# EAGLE schematic ACB Jr. r.02 (EAGLE 8.6.3)
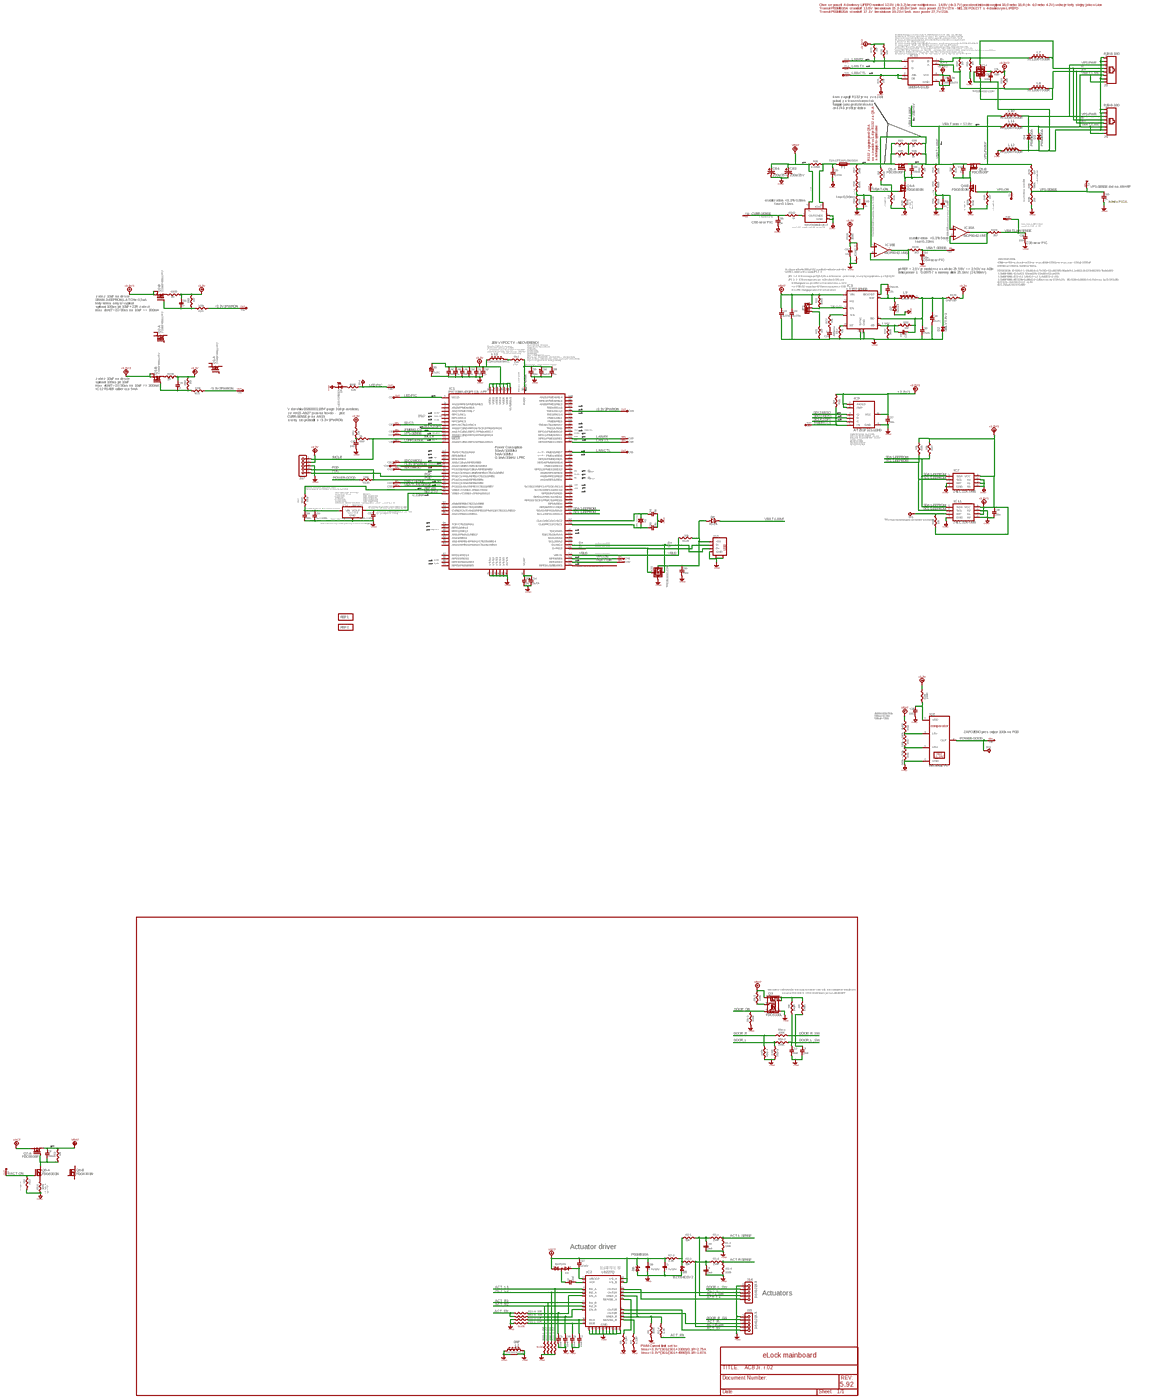
[diagram p0: schematic, sheet 1, overview]
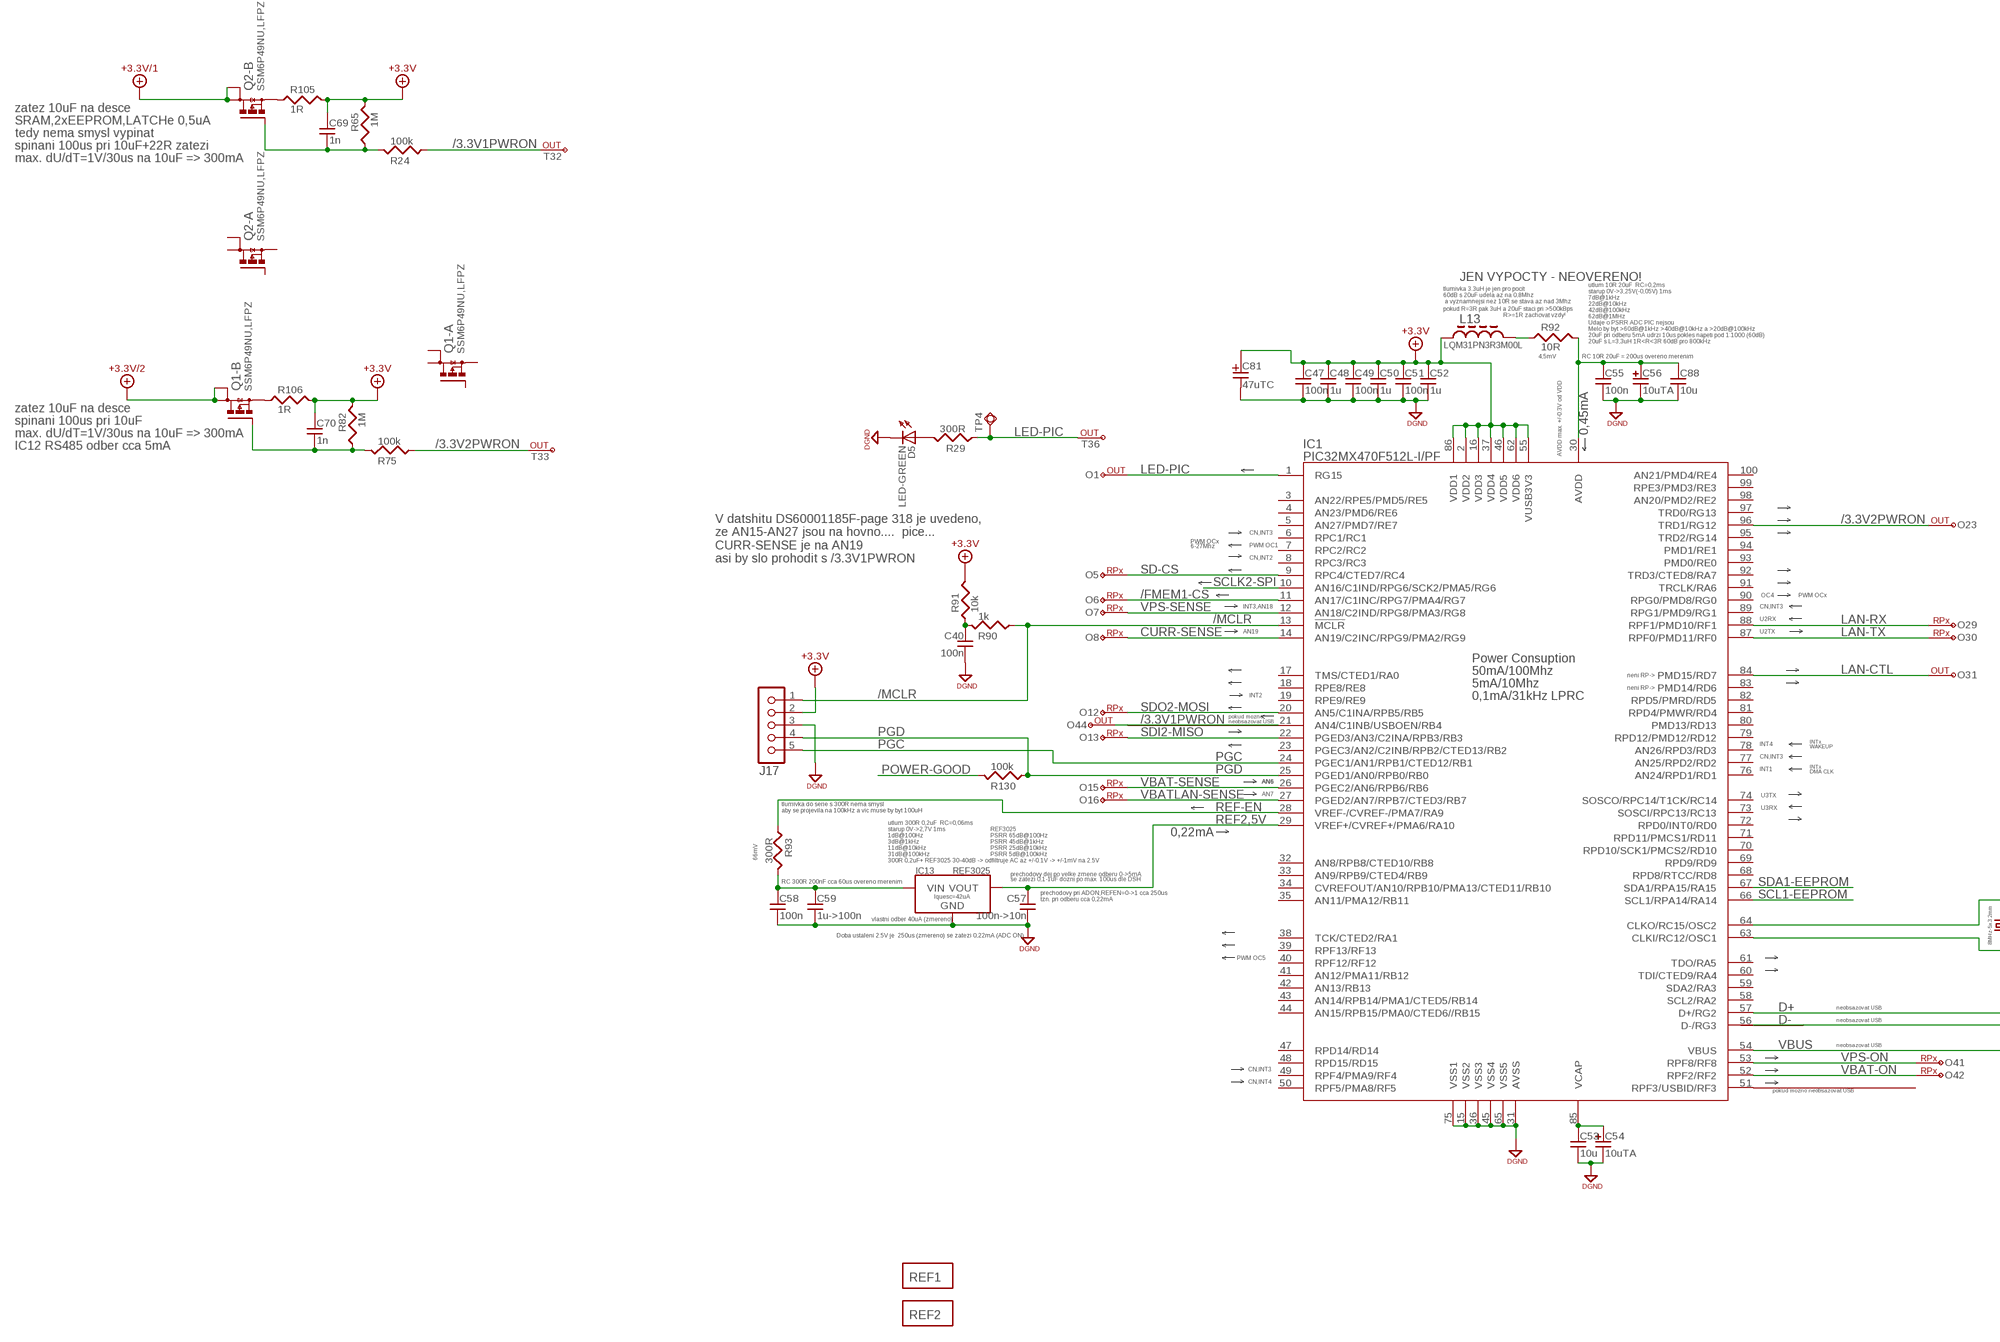
[diagram p1: schematic, sheet 1, part 1 of 5]
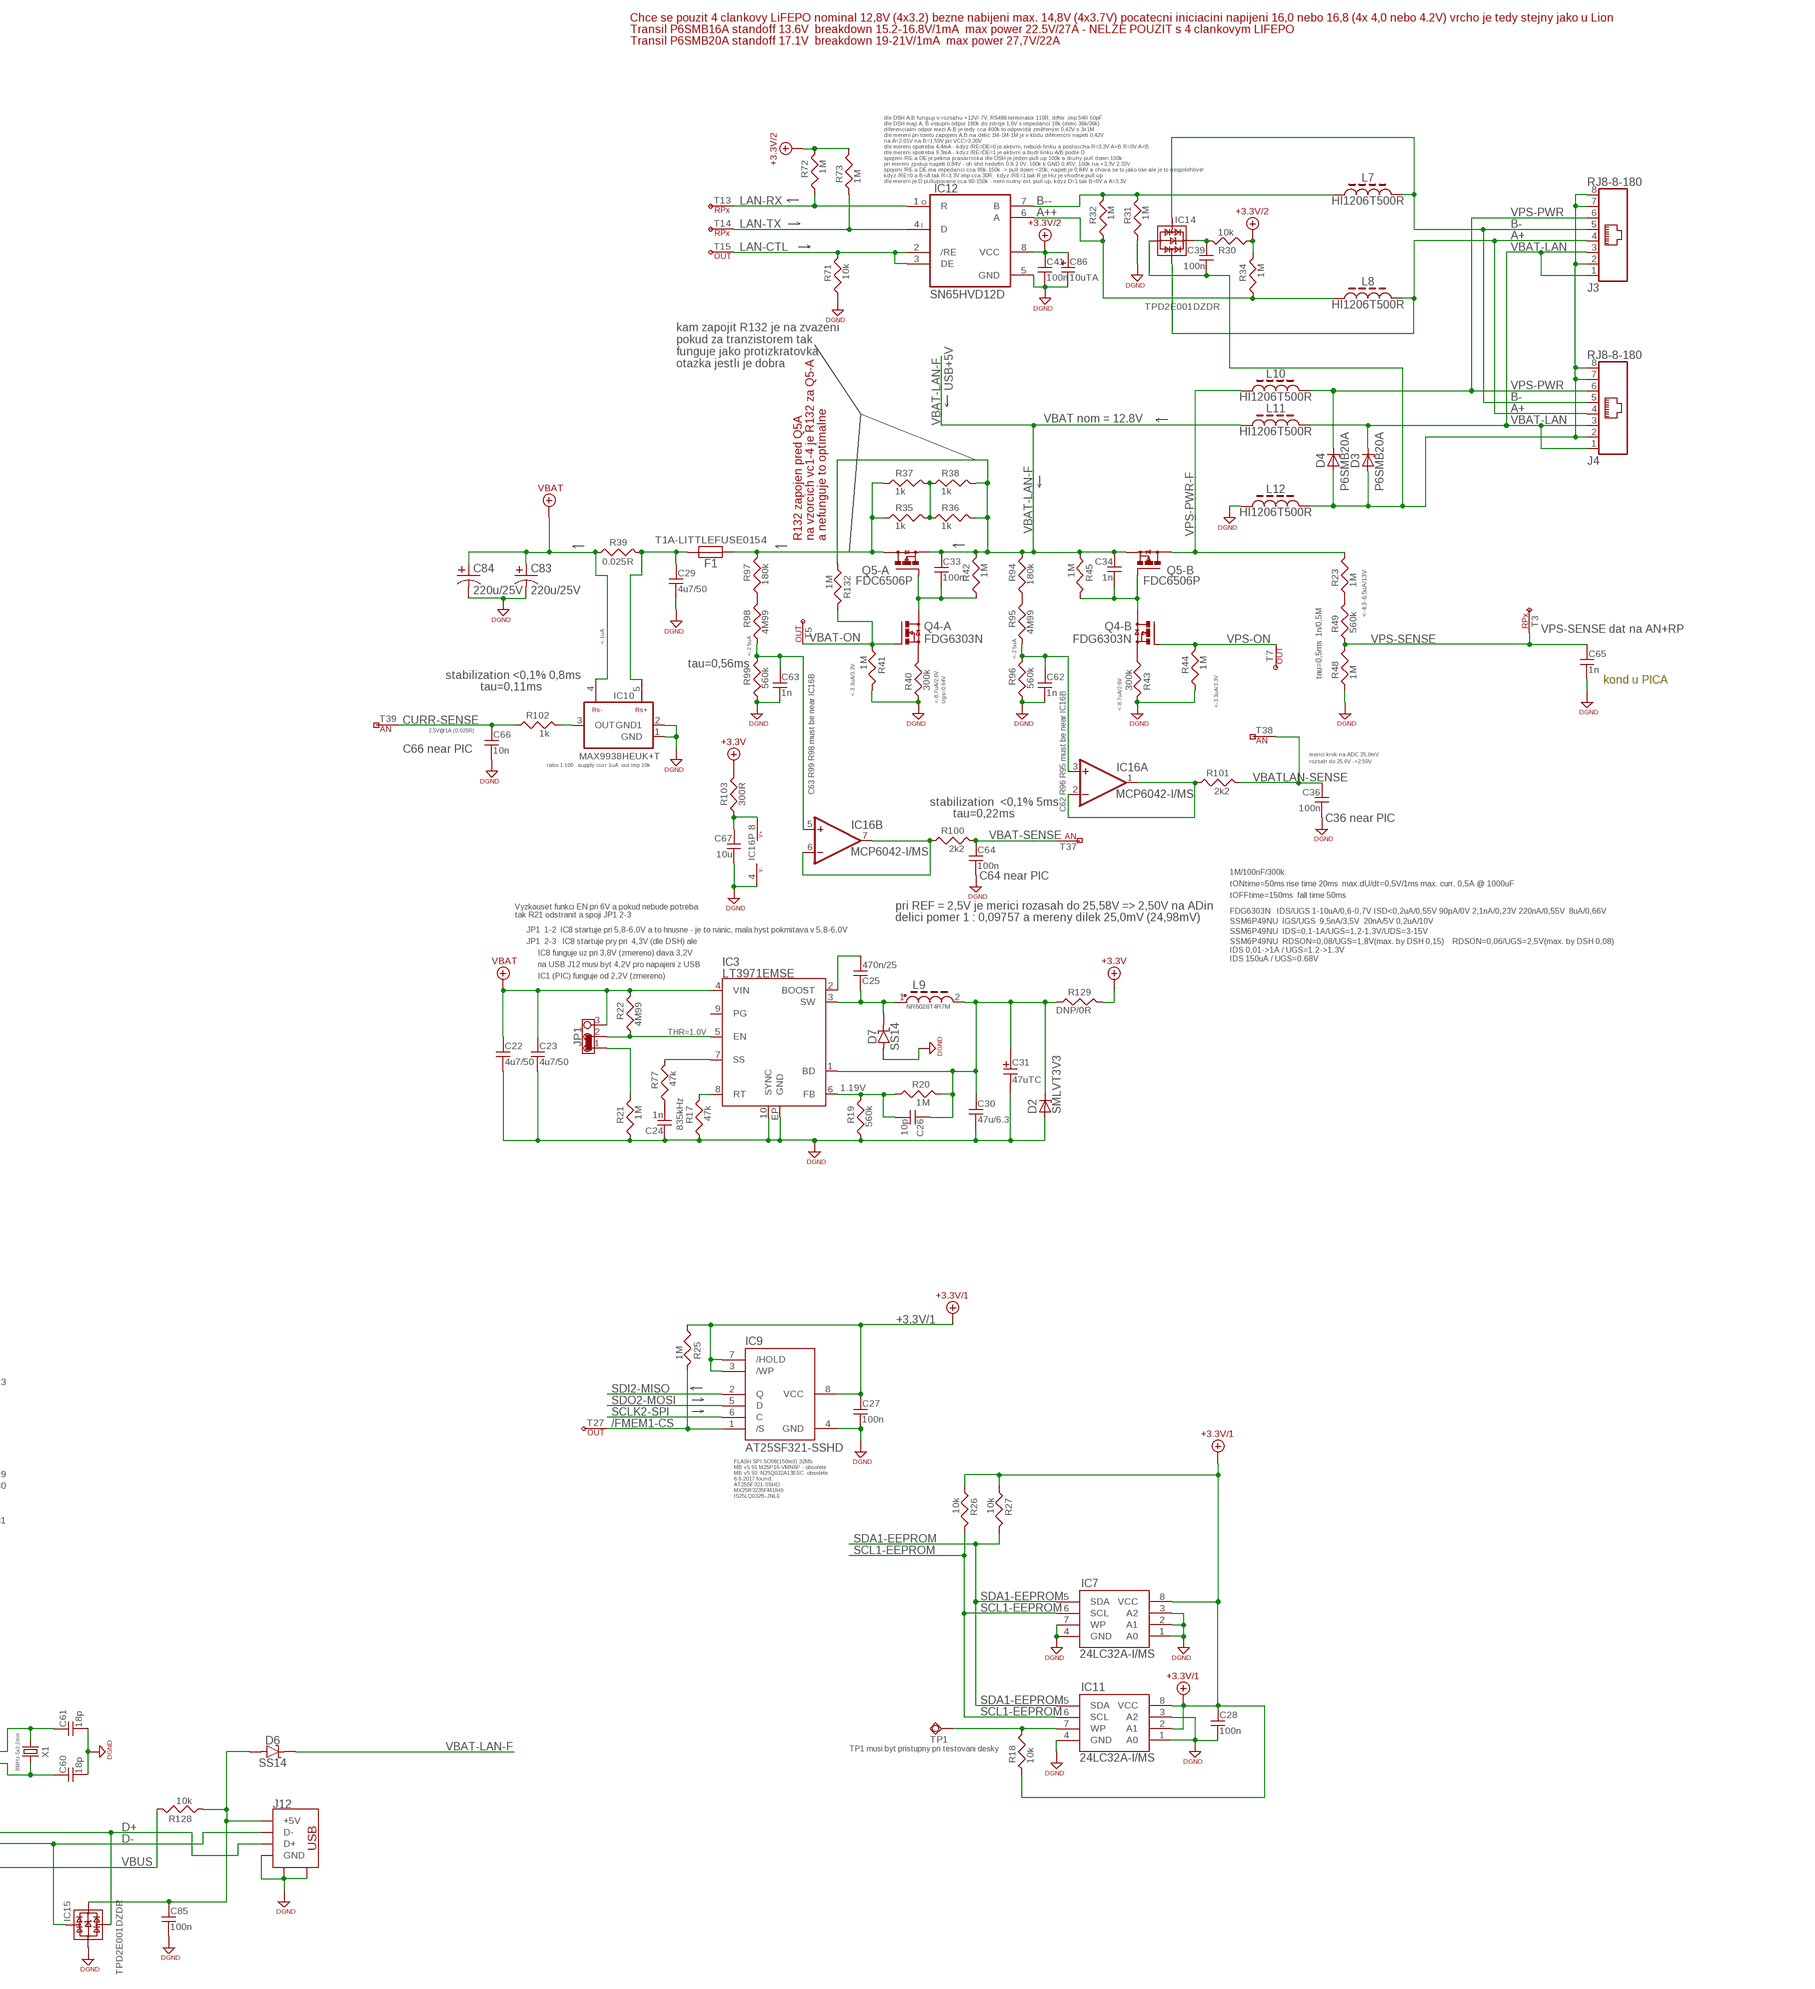
[diagram p2: schematic, sheet 1, part 2 of 5]
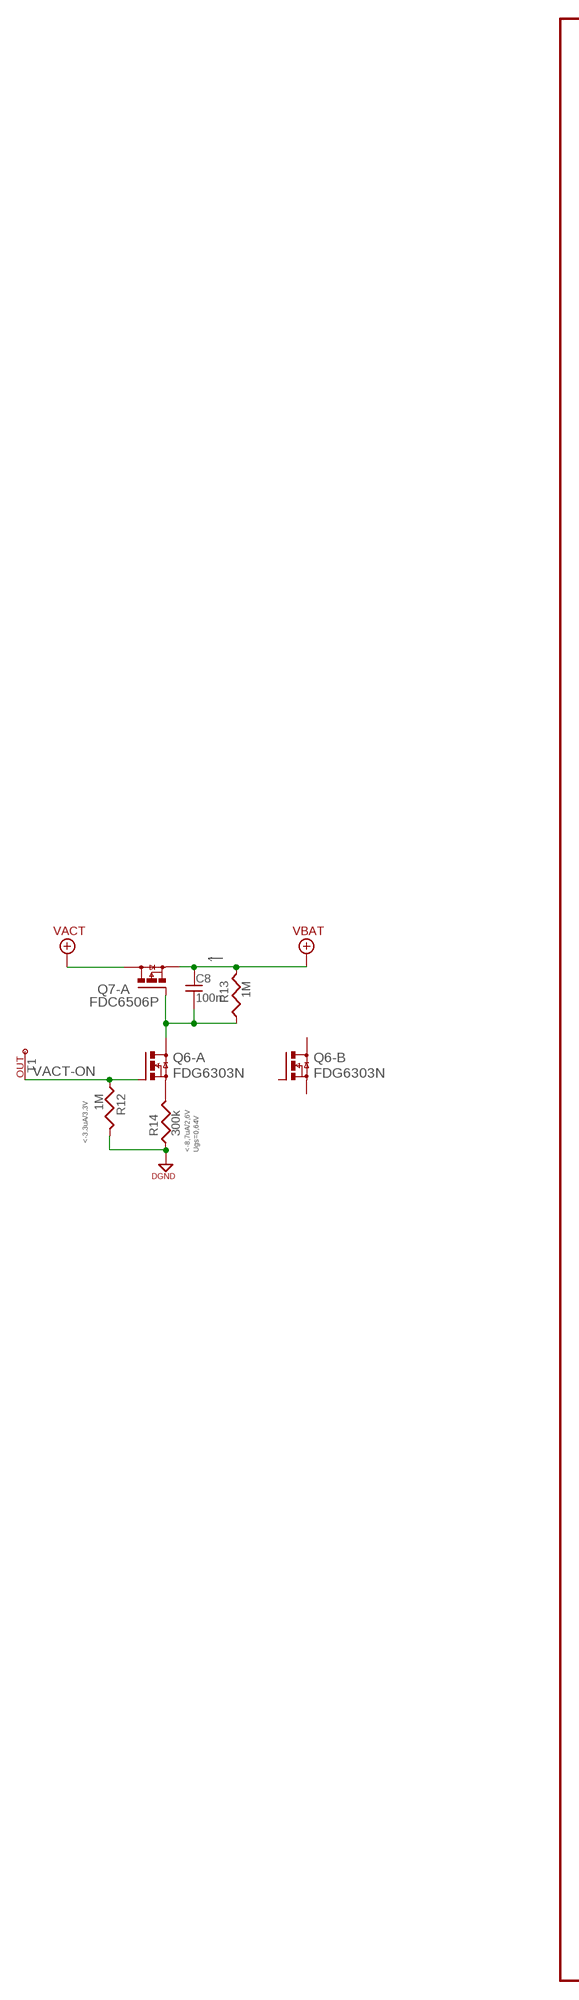
[diagram p3: schematic, sheet 1, part 3 of 5]
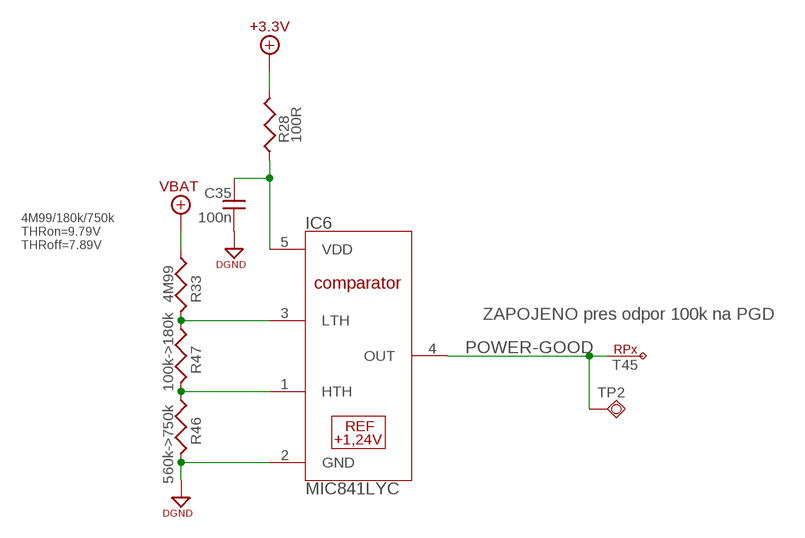
[diagram p4: schematic, sheet 1, part 4 of 5]
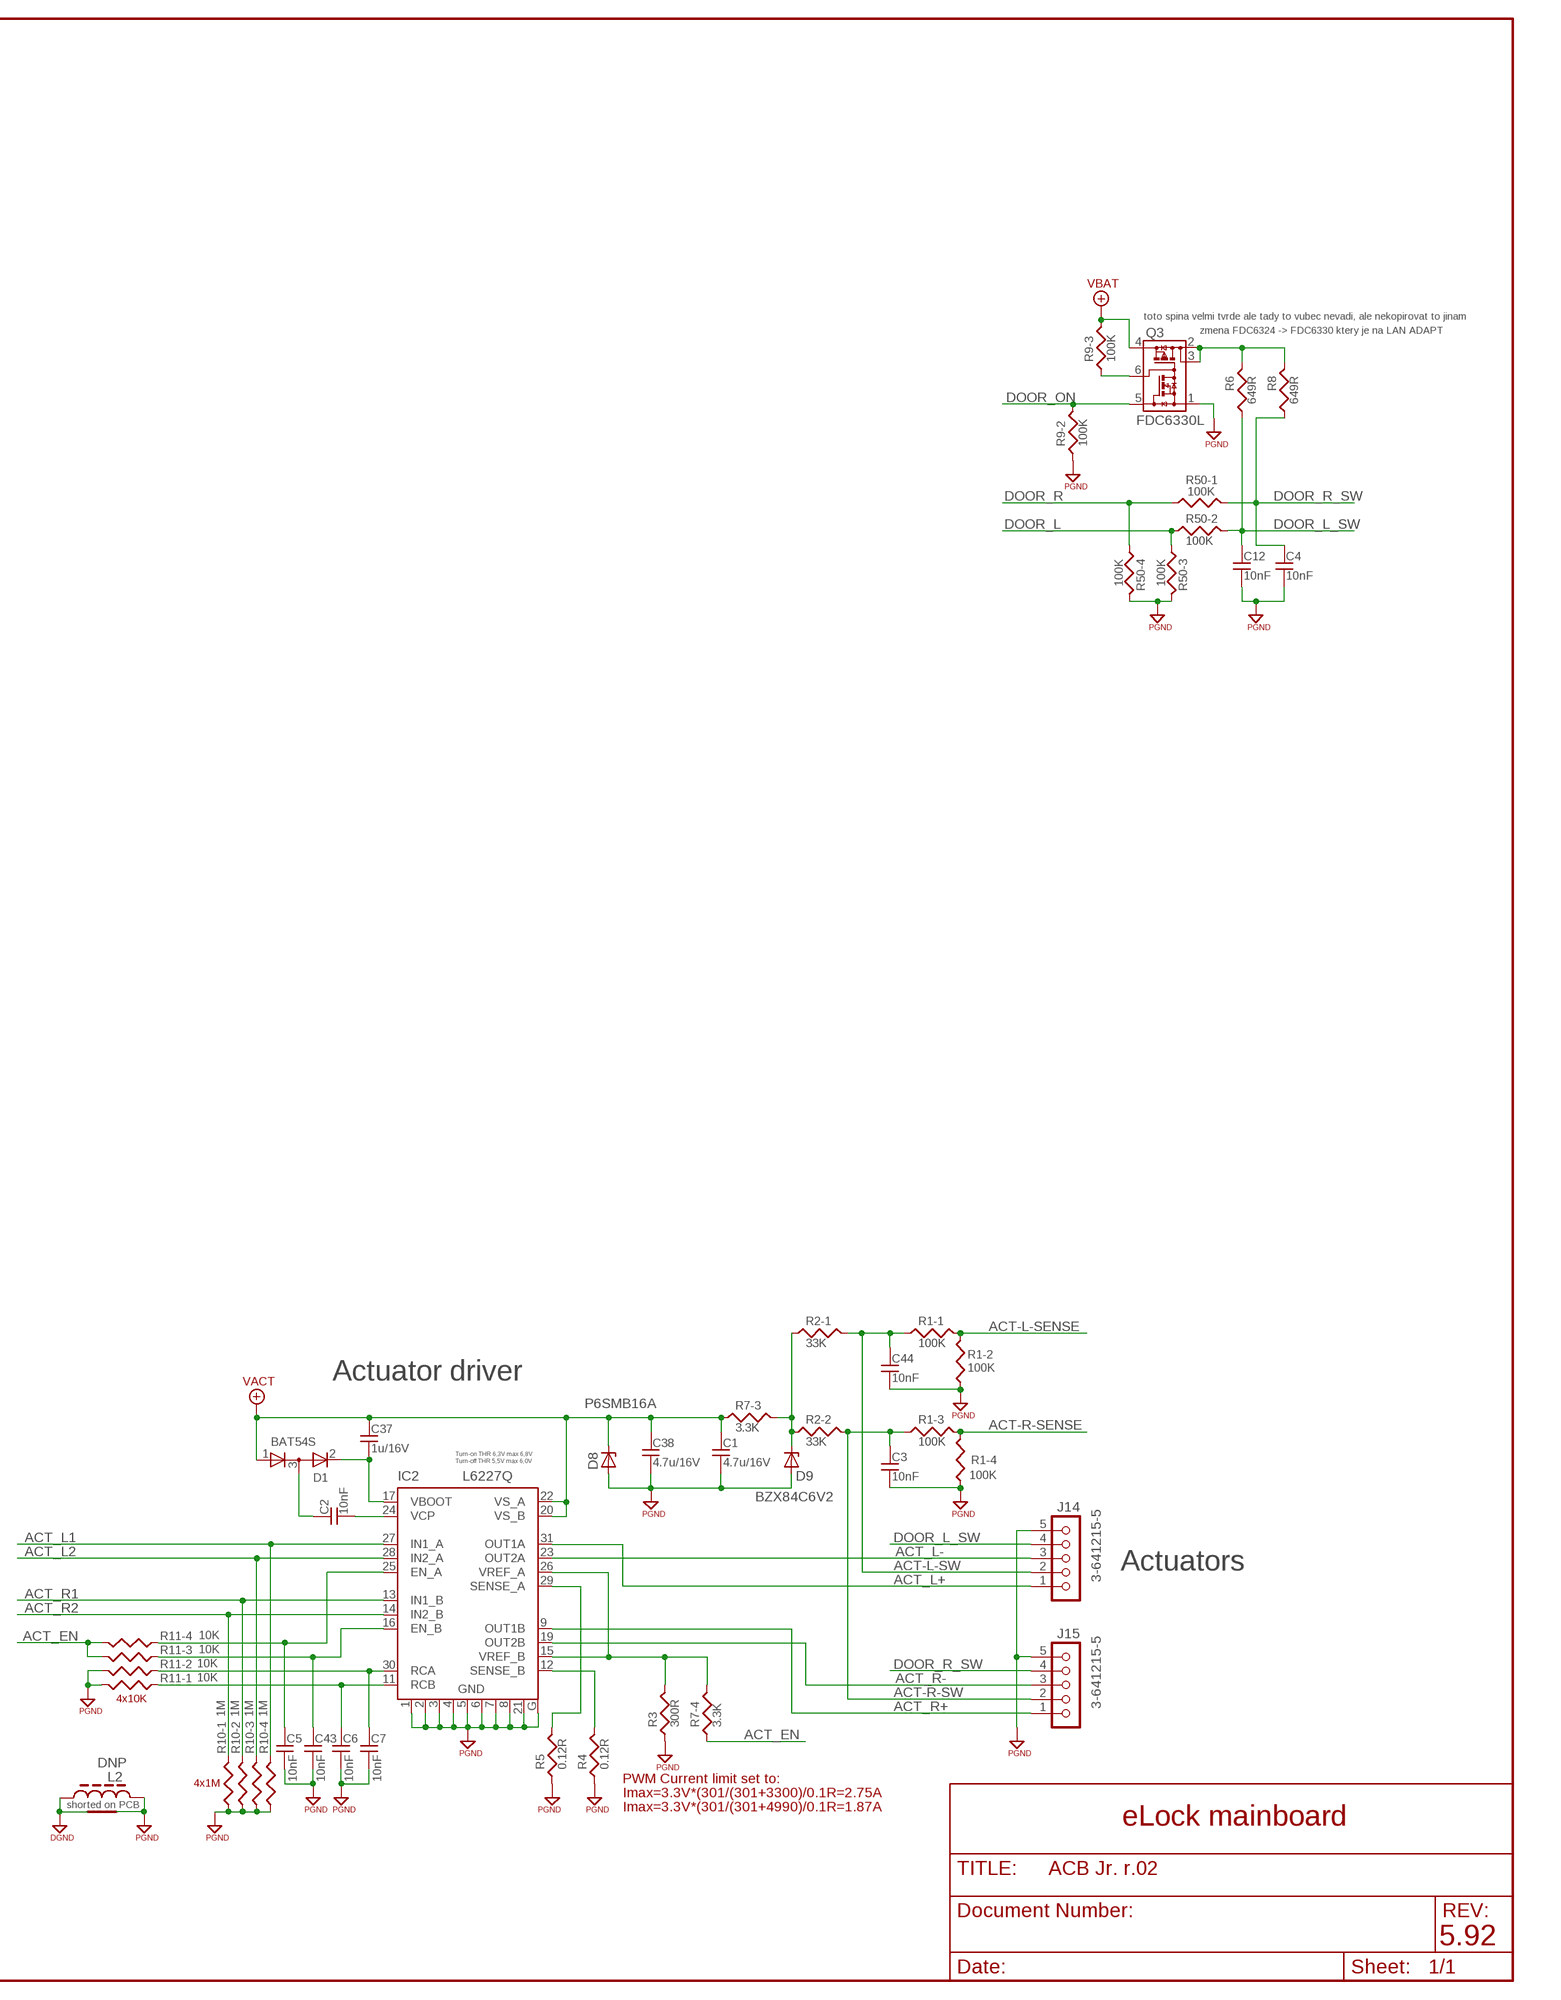
[diagram p5: schematic, sheet 1, part 5 of 5]

## Parts
C1  4.7u/16V  C-0805  [0805]
C2  10nF  C-0603  [0603]
C3  10nF  C-0603  [0603]
C4  10nF  C-0603  [0603]
C5  10nF  C-0603  [0603]
C6  10nF  C-0603  [0603]
C7  10nF  C-0603  [0603]
C8  100n  C-0603  [0603]
C12  10nF  C-0603  [0603]
C22  4u7/50  C-1206  [1206]
C23  4u7/50  C-1206  [1206]
C24  1n  C-0603  [0603]
C25  470n/25  C-0603  [0603]
C26  10p  C-0603  [0603]
C27  100n  C-0603  [0603]
C28  100n  C-0603  [0603]
C29  4u7/50  C-1206  [1206]
C30  47u/6.3  C-1206  [1206]
C31  47uTC  CT-C  [CT-C]
C33  100n  C-0603  [0603]
C34  1n  C-0603  [0603]
C35  100n  C-0603  [0603]
C36  100n  C-0603  [0603]
C37  1u/16V  C-0603  [0603]
C38  4.7u/16V  C-0805  [0805]
C39  100n  C-0603  [0603]
C40  100n  C-0603  [0603]
C41  100n  C-0603  [0603]
C43  10nF  C-0603  [0603]
C44  10nF  C-0603  [0603]
C47  100n  C-0603  [0603]
C48  1u  C-0603  [0603]
C49  100n  C-0603  [0603]
C50  1u  C-0603  [0603]
C51  100n  C-0603  [0603]
C52  1u  C-0603  [0603]
C53  10u  C-0603  [0603]
C54  10uTA  CT-1206  [1206-POL-C]
C55  100n  C-0603  [0603]
C56  10uTA  CT-1206  [1206-POL-C]
C57  100n->10n  C-0603  [0603]
C58  100n  C-0603  [0603]
C59  1u->100n  C-0603  [0603]
C60  18p  C-0603  [0603]
C61  18p  C-0603  [0603]
C62  1n  C-0603  [0603]
C63  1n  C-0603  [0603]
C64  100n  C-0603  [0603]
C65  1n  C-0603  [0603]
C66  10n  C-0603  [0603]
C67  10u  C-0603  [0603]
C69  1n  C-0603  [0603]
C70  1n  C-0603  [0603]
C81  47uTC  CT-C  [CT-C]
C83  220u/25V  CAP-ELEC-SMD-8MM  [CAP_8MM_DIA_SMT]
C84  220u/25V  CAP-ELEC-SMD-8MM  [CAP_8MM_DIA_SMT]
C85  100n  C-0603  [0603]
C86  10uTA  CT-1206  [1206-POL-C]
C88  10u  C-0603  [0603]
D1  BAT54S  [SOT-23]
D2  SMLVT3V3  [SMA]
D3  P6SMB20A  P6SMB  [SMB]
D4  P6SMB20A  P6SMB  [SMB]
D5  LED-GREEN  LED-0805  [0805-POL-D]
D6  SS14  DS-SMA  [SMA]
D7  SS14  DS-SMA  [SMA]
D8  P6SMB16A  P6SMB  [SMB]
D9  BZX84C6V2  [SOT-23]
F1  T1A-LITTLEFUSE0154  POJISTKA-LITTLEFUSE0154  [LITTLEFUSE0154]
IC1  PIC32MX470F512L-I/PF  [TQFP100_14X14_0,5MM]
IC2  L6227Q  [SQFP-S-5X5-32]
IC3  LT3971EMSE  [MSOP10EXP]
IC6  MIC841LYC  [SC-70-5]
IC7  24LC32A-I/MS  24-I/MS  [MSOP-08]
IC9  AT25SF321-SSHD  M25P16-VMN6P  [SO-08]
IC10  MAX9938HEUK+T  TSM9938HEUK+T  [SOT23-5]
IC11  24LC32A-I/MS  24-I/MS  [MSOP-08]
IC12  SN65HVD12D  SN65HVD3082ED  [SO08]
IC13  REF3025  [SOT23]
IC14  TPD2E001DZDR  SR05.TCT  [SOT-143]
IC15  TPD2E001DZDR  SR05.TCT  [SOT-143]
IC16  MCP6042-I/MS  [MSOP-08]
J3  RJ8-8-180  [RJ8-8-180]
J4  RJ8-8-180  [RJ8-8-180]
J12  USB_A_180  USB_B_180  [USB_B_180]
J14  3-641215-5  [3-641215-5]
J15  3-641215-5  [3-641215-5]
J17  DNP-open-hole  MA05-1  [MA05-1]
JP1  JP3CLOSE12  [JP3CLOSE12]
L2  DNP  L-0805-0R  [0805-0RTOP]
L7  HI1206T500R  L-1206  [1206]
L8  HI1206T500R  L-1206  [1206]
L9  NR6028T4R7M  NR6028  [NR6028]
L10  HI1206T500R  L-1206  [1206]
L11  HI1206T500R  L-1206  [1206]
L12  HI1206T500R  L-1206  [1206]
L13  LQM31PN3R3M00L  L-1206  [1206]
O1  PIC-OUT  [TEMP-PAD]
O5  PIC-RPX  [TEMP-PAD]
O6  PIC-RPX  [TEMP-PAD]
O7  PIC-RPX  [TEMP-PAD]
O8  PIC-RPX  [TEMP-PAD]
O12  PIC-RPX  [TEMP-PAD]
O13  PIC-RPX  [TEMP-PAD]
O15  PIC-RPX  [TEMP-PAD]
O16  PIC-RPX  [TEMP-PAD]
O23  PIC-OUT  [TEMP-PAD]
O29  PIC-RPX  [TEMP-PAD]
O30  PIC-RPX  [TEMP-PAD]
O31  PIC-OUT  [TEMP-PAD]
O41  PIC-RPX  [TEMP-PAD]
O42  PIC-RPX  [TEMP-PAD]
O44  PIC-OUT  [TEMP-PAD]
Q1  SSM6P49NU,LFPZ  [MICRO_FET]
Q2  SSM6P49NU,LFPZ  [MICRO_FET]
Q3  FDC6330L  [SSOT-6]
Q4  FDG6303N  [SC70-6]
Q5  FDC6506P  FDC6506D  [SSOT-6]
Q6  FDG6303N  [SC70-6]
Q7  FDC6506P  FDC6506D  [SSOT-6]
R1  100K  EXB-38  [0603-ARRAY]
R2  33K  EXB-38  [0603-ARRAY]
R3  300R  R-0603  [0603]
R4  0.12R  R-0805  [0805]
R5  0.12R  R-0805  [0805]
R6  649R  R-0603  [0603]
R7  3.3K  EXB-38  [0603-ARRAY]
R8  649R  R-0603  [0603]
R9  100K  EXB-38  [0603-ARRAY]
R10  1M  EXB-38  [0603-ARRAY]
R11  10K  EXB-38  [0603-ARRAY]
R12  1M  R-0603  [0603]
R13  1M  R-0603  [0603]
R14  300k  R-0603  [0603]
R17  47k  R-0603  [0603]
R18  10k  R-0603  [0603]
R19  560k  R-0603  [0603]
R20  1M  R-0603  [0603]
R21  1M  R-0603  [0603]
R22  4M99  R-0603  [0603]
R23  1M  R-0603  [0603]
R24  100k  R-0603  [0603]
R25  1M  R-0603  [0603]
R26  10k  R-0603  [0603]
R27  10k  R-0603  [0603]
R28  100R  R-0603  [0603]
R29  300R  R-0603  [0603]
R30  10k  R-0603  [0603]
R31  1M  R-0603  [0603]
R32  1M  R-0603  [0603]
R33  4M99  R-0603  [0603]
R34  1M  R-0603  [0603]
R35  1k  R-0805  [0805]
R36  1k  R-0805  [0805]
R37  1k  R-0805  [0805]
R38  1k  R-0805  [0805]
R39  0.025R  R-0805  [0805]
R40  300k  R-0603  [0603]
R41  1M  R-0603  [0603]
R42  1M  R-0603  [0603]
R43  300k  R-0603  [0603]
R44  1M  R-0603  [0603]
R45  1M  R-0603  [0603]
R46  560k->750k  R-0603  [0603]
R47  100k->180k  R-0603  [0603]
R48  1M  R-0603  [0603]
R49  560k  R-0603  [0603]
R50  100K  EXB-38  [0603-ARRAY]
R65  1M  R-0603  [0603]
R71  10k  R-0603  [0603]
R72  1M  R-0603  [0603]
R73  1M  R-0603  [0603]
R75  100k  R-0603  [0603]
R77  47k  R-0603  [0603]
R82  1M  R-0603  [0603]
R90  1k  R-0603  [0603]
R91  10k  R-0603  [0603]
R92  10R  R-0603  [0603]
R93  300R  R-0603  [0603]
R94  180k  R-0603  [0603]
R95  4M99  R-0603  [0603]
R96  560k  R-0603  [0603]
R97  180k  R-0603  [0603]
R98  4M99  R-0603  [0603]
R99  560k  R-0603  [0603]
R100  2k2  R-0603  [0603]
R101  2k2  R-0603  [0603]
R102  1k  R-0603  [0603]
R103  300R  R-0603  [0603]
R105  1R  R-0805  [0805]
R106  1R  R-0805  [0805]
R128  10k  R-0603  [0603]
R129  DNP/0R  R-0603  [0603]
R130  100k  R-0603  [0603]
R132  1M  R-0603  [0603]
REF1  REF  [REF]
REF2  REF  [REF]
T1  PIC-OUT  [TEMP-PAD]
T3  PIC-RPX  [TEMP-PAD]
T5  PIC-OUT  [TEMP-PAD]
T7  PIC-OUT  [TEMP-PAD]
T13  PIC-RPX  [TEMP-PAD]
T14  PIC-RPX  [TEMP-PAD]
T15  PIC-OUT  [TEMP-PAD]
T27  PIC-OUT  [TEMP-PAD]
T32  PIC-OUT  [TEMP-PAD]
T33  PIC-OUT  [TEMP-PAD]
T36  PIC-OUT  [TEMP-PAD]
T37  PIN-AN  [TEMP-PAD]
T38  PIN-AN  [TEMP-PAD]
T39  PIN-AN  [TEMP-PAD]
T45  PIC-RPX  [TEMP-PAD]
TP1  DNP-TestPoint  ROUND_SMD1MM  [SMD_ROUND_1MM]
TP2  DNP-TestPoint  ROUND_SMDTH1.4MM  [TH_ROUND_14MM08MM]
TP4  DNP-TestPoint  ROUND_SMDTH1.4MM  [TH_ROUND_14MM08MM]
X1  8MHz-5x3.2mm  XTAL-7B  [7B]

## Nets
+3,3V-FILT: C35.1 IC6.5(VDD) R28.1
+3.3V: C47.1 C48.1 C49.1 C50.1 C51.1 C52.1 C69.1 C70.1 C81.+ IC1.2(VDD2) IC1.16(VDD3) IC1.37(VDD4) IC1.46(VDD5) IC1.55(VUSB3V3) IC1.62(VDD6) IC1.86(VDD1) J17.2 L13.1 R28.2 R65.1 R82.1 R91.2 R103.2 R105.2 R106.2 R129.1
+3.3V/1: C27.1 C28.1 IC7.8(VCC) IC9.3(/WP) IC9.7(/HOLD) IC9.8(VCC) IC11.2(A1) IC11.8(VCC) Q2.3(-B:D) Q2.P2(-B:D1) R18.1 R25.2 R26.1 R27.1
+3.3V/2: C41.1 C86.+ IC12.8(VCC) Q1.3(-B:D) Q1.P2(-B:D1) R30.2 R34.1 R72.1 R73.2
/3.3V1PWRON: IC1.21(AN4/C1INB/USBOEN/RB4) O44.P$1(TP) R24.2 T32.P$1(TP)
/3.3V2PWRON: IC1.96(TRD1/RG12) O23.P$1(TP) R75.2 T33.P$1(TP)
/FMEM1-CS: IC1.11(AN17/C1INC/RPG7/PMA4/RG7) IC9.1(/S) O6.P$1(TP) R25.1 T27.P$1(TP)
/MCLR: IC1.13(!MCLR) J17.1 R90.2
A+ [HV]: IC14.3 J3.4 J4.4 L8.2
A++ [HV]: IC12.6(A) L8.1 R32.2 R34.2
ACT-L-SENSE: R1.7 R1.8
ACT-L-SW: C44.1 J14.2 R1.1 R2.8
ACT-R-SENSE: R1.5 R1.6
ACT-R-SW: C3.1 J15.2 R1.3 R2.7
ACT_EN: R7.4 R11.5 R11.6
ACT_L1: IC2.27(IN1_A) R10.5
ACT_L2: IC2.28(IN2_A) R10.6
ACT_L+: IC2.31(OUT1A) J14.1
ACT_L-: IC2.23(OUT2A) J14.3
ACT_R1: IC2.13(IN1_B) R10.7
ACT_R2: IC2.14(IN2_B) R10.8
ACT_R+: IC2.9(OUT1B) J15.1
ACT_R-: IC2.19(OUT2B) J15.3
AVDD: C55.1 C56.+ C88.1 IC1.30(AVDD) R92.2
B- [HV]: IC14.2 J3.5 J4.5 L7.2
B-- [HV]: IC12.7(B) L7.1 R31.1 R32.1
CURR-SENSE: C66.1 IC1.14(AN19/C2INC/RPG9/PMA2/RG9) O8.P$1(TP) R102.2 T39.P$1(TP)
D+: IC1.57(D+/RG2) IC15.3 J12.3_D+(D+)
D-: IC1.56(D-/RG3) IC15.2 J12.2_D-(D-)
DGND [GND]: C22.2 C23.2 C24.1 C27.2 C28.2 C29.2 C30.2 C31.- C35.2 C36.2 C40.2 C41.2 C47.2 C48.2 C49.2 C50.2 C51.2 C52.2 C53.2 C54.- C55.2 C56.- C57.2 C58.2 C59.2 C60.2 C61.2 C62.2 C63.2 C64.2 C65.2 C66.2 C67.2 C81.- C83.2 C84.2 C85.2 C86.- C88.2 D2.-(A) D5.K D7.A IC1.15(VSS2) IC1.31(AVSS) IC1.36(VSS3) IC1.45(VSS4) IC1.65(VSS5) IC1.75(VSS1) IC3.10(SYNC) IC3.EP(GND) IC6.2(GND) IC7.1(A0) IC7.2(A1) IC7.3(A2) IC7.4(GND) IC7.7(WP) IC9.4(GND) IC10.1(GND) IC10.2(GND1) IC11.1(A0) IC11.3(A2) IC11.4(GND) IC12.5(GND) IC13.3(GND) IC15.1 IC16.4(P:V-) J12.4_GND(GND) J12.SH1(GND_SH1) J12.SH2(GND_SH2) J17.3 L2.2 L12.1 R12.2 R14.1 R17.2 R19.2 R21.2 R31.2 R40.1 R41.2 R43.1 R44.2 R46.1 R48.1 R71.2 R96.2 R99.2
DGND-F [HV]: C39.2 D3.A D4.A IC14.1 J3.2 J3.7 J3.8 J4.2 J4.7 J4.8 L12.2
DOOR_L: R50.2 R50.3
DOOR_L_SW: C12.1 J14.4 R6.2 R50.7
DOOR_ON: Q3.5(Q1G) R9.7
DOOR_R: R50.1 R50.4
DOOR_R_SW: C4.1 J15.4 R8.2 R50.8
GATE-Q12A: C33.2 Q4.6(-A:D) Q5.1(-A:G) R42.2
GATE-Q12A1: C8.2 Q6.6(-A:D) Q7.1(-A:G) R13.2
GATE-Q12B: C34.2 Q4.3(-B:D) Q5.3(-B:G) R45.2
LAN-CTL: IC1.84(PMD15/RD7) IC12.2(/RE) IC12.3(DE) O31.P$1(TP) R71.1 T15.P$1(TP)
LAN-RX: IC1.88(RPF1/PMD10/RF1) IC12.1(R) O29.P$1(TP) R72.2 T13.P$1(TP)
LAN-TX: IC1.87(RPF0/PMD11/RF0) IC12.4(D) O30.P$1(TP) R73.1 T14.P$1(TP)
LED-PIC: IC1.1(RG15) O1.P$1(TP) R29.1 T36.P$1(TP) TP4.P$1(TP)
N$1: C5.1 IC2.25(EN_A) R11.4
N$2: C43.1 IC2.16(EN_B) R11.3
N$3: C6.1 IC2.11(RCB) R11.1
N$4: Q6.1(-A:S) R14.2
N$6: C2.2 IC2.24(VCP)
N$13: IC11.7(WP) R18.2 TP1.P$1(TP)
N$14: D5.A R29.2
N$16: Q4.1(-A:S) R40.2
N$17: Q4.4(-B:S) R43.2
N$18: C39.1 IC14.4 R30.1
N$19: C2.1 D1.3(KA)
N$20 [HV]: R35.2 R36.1 R37.2 R38.1
N$21 [HV]: C29.1 F1.1 IC10.5(VIN+) R39.2
N$24: L13.2 R92.1
N$27: IC6.1(HTH) R46.2 R47.1
N$28: IC6.3(LTH) R33.1 R47.2
N$29: D9.3(C) R2.1 R2.2 R7.6
N$31: IC2.12(SENSE_B) R4.2
N$32: C61.1 IC1.64(CLKO/RC15/OSC2) X1.1
N$35: Q3.6(Q2G) R9.3
N$36: Q1.4(-B:S) R106.1
N$38 [HV]: F1.2 Q5.6(-A:D) R35.1 R37.1 R97.1
N$39: C60.1 IC1.63(CLKI/RC12/OSC1) X1.3
N$40: Q3.2(Q2D1) Q3.3(Q2D2) R6.1 R8.1
N$41: IC2.29(SENSE_A) R5.2
N$44: C58.1 C59.1 IC13.1(VIN) R93.2
N$47: C37.2 D1.2(K) IC2.17(VBOOT)
N$48: R94.2 R95.1
N$49: C62.1 IC16.3(A:+IN) R95.2 R96.1
N$50: C26.2 IC3.6(FB) R19.1 R20.2
N$51: C24.2 R77.2
N$52 [HV]: C25.1 D7.K IC3.3(SW) L9.1
N$53: IC3.8(RT) R17.1
N$54: IC3.7(SS) R77.1
N$55 [HV]: IC3.5(EN) JP1.2 R22.2
N$56: Q2.4(-B:S) R105.1
N$57 [HV]: C25.2 IC3.2(BOOST)
N$60: R97.2 R98.1
N$62: R23.1 R49.2
N$63: C63.1 IC16.5(B:+IN) R98.2 R99.1
N$64: IC16.6(B:-IN) IC16.7(B:OUT) R100.2
N$65: C67.1 IC16.8(P:V+) R103.1
N$66: IC16.1(A:OUT) IC16.2(A:-IN) R101.2
N$67: C69.2 Q2.5(-B:G) R24.1 R65.2
N$68: IC10.3(OUT) R102.1
N$70: C40.1 R90.1 R91.1
N$71: C7.1 IC2.30(RCA) R11.2
N$73: C70.2 Q1.5(-B:G) R75.1 R82.2
N$78: IC2.15(VREF_B) IC2.26(VREF_A) R3.2 R7.5
N$85 [HV]: C85.1 D6.A IC15.4 J12.1_+5V(+5V) R128.1
N$87 [HV]: JP1.1 R21.1
OUT+3.3V [GND]: C26.1 C30.1 C31.+ D2.+(C) IC3.1(BD) L9.2 R20.1 R129.2
PGC: IC1.24(PGEC1/AN1/RPB1/CTED12/RB1) J17.5
PGD: IC1.25(PGED1/AN0/RPB0/RB0) J17.4 R130.2
PGND: C1.2 C3.2 C4.2 C5.2 C6.2 C7.2 C12.2 C38.2 C43.2 C44.2 D8.A D9.1(A) IC2.1(GND1) IC2.2(GND2) IC2.3(GND3) IC2.4(GND4) IC2.5(GND5) IC2.6(GND6) IC2.7(GND7) IC2.8(GND8) IC2.21(GND21) IC2.G(GNEXP) J14.5 J15.5 L2.1 Q3.1(Q1S) R1.2 R1.4 R3.1 R4.1 R5.1 R9.2 R10.1 R10.2 R10.3 R10.4 R11.7 R11.8 R50.5 R50.6
POWER-GOOD: IC6.4(OUT) R130.1 T45.P$1(TP) TP2.P$1(TP)
REF2,5V: C57.1 IC1.29(VREF+/CVREF+/PMA6/RA10) IC13.2(VOUT)
REF-EN: IC1.28(VREF-/CVREF-/PMA7/RA9) R93.1
SCL1-EEPROM: IC1.66(SCL1/RPA14/RA14) IC7.6(SCL) IC11.6(SCL) R26.2
SCLK2-SPI: IC1.10(AN16/C1IND/RPG6/SCK2/PMA5/RG6) IC9.6(C)
SD-CS: IC1.9(RPC4/CTED7/RC4) O5.P$1(TP)
SDA1-EEPROM: IC1.67(SDA1/RPA15/RA15) IC7.5(SDA) IC11.5(SDA) R27.2
SDI2-MISO: IC1.22(PGED3/AN3/C2INA/RPB3/RB3) IC9.2(Q) O13.P$1(TP)
SDO2-MOSI: IC1.20(AN5/C1INA/RPB5/RB5) IC9.5(D) O12.P$1(TP)
VACT: C1.1 C37.1 C38.1 D1.1(A) D8.C IC2.20(VS_B) IC2.22(VS_A) Q7.6(-A:D) R7.3
VACT-ON: Q6.2(-A:G) R12.1 T1.P$1(TP)
VBAT [HV]: C8.1 C22.1 C23.1 C83.1 C84.1 IC3.4(VIN) IC10.4(VIN-) JP1.3 Q3.4(Q2S) Q7.5(-A:S) R9.6 R13.1 R22.1 R33.2 R39.1
VBAT-LAN [HV]: D3.C J3.1 J3.3 J4.1 J4.3 L11.2
VBAT-LAN-F [HV]: C33.1 C34.1 D6.K L11.1 Q5.2(-B:S) Q5.5(-A:S) R36.2 R38.2 R42.1 R45.1 R94.1 R132.1
VBAT-ON: IC1.52(RPF2/RF2) O42.P$1(TP) Q4.2(-A:G) R41.1 R132.2 T5.P$1(TP)
VBAT-SENSE: C64.1 IC1.26(PGEC2/AN6/RPB6/RB6) O15.P$1(TP) R100.1 T37.P$1(TP)
VBATLAN-SENSE: C36.1 IC1.27(PGED2/AN7/RPB7/CTED3/RB7) O16.P$1(TP) R101.1 T38.P$1(TP)
VBUS: IC1.54(VBUS) R128.2
VCAP: C53.1 C54.+ IC1.85(VCAP)
VPS-ON: IC1.53(RPF8/RF8) O41.P$1(TP) Q4.5(-B:G) R44.1 T7.P$1(TP)
VPS-PWR [HV]: D4.C J3.6 J4.6 L10.2
VPS-PWR-F: L10.1 Q5.4(-B:D) R23.2
VPS-SENSE: C65.1 IC1.12(AN18/C2IND/RPG8/PMA3/RG8) O7.P$1(TP) R48.2 R49.1 T3.P$1(TP)
Unconnected: IC1.3(AN22/RPE5/PMD5/RE5) IC1.4(AN23/PMD6/RE6) IC1.5(AN27/PMD7/RE7) IC1.6(RPC1/RC1) IC1.7(RPC2/RC2) IC1.8(RPC3/RC3) IC1.17(TMS/CTED1/RA0) IC1.18(RPE8/RE8) IC1.19(RPE9/RE9) IC1.23(PGEC3/AN2/C2INB/RPB2/CTED13/RB2) IC1.32(AN8/RPB8/CTED10/RB8) IC1.33(AN9/RPB9/CTED4/RB9) IC1.34(CVREFOUT/AN10/RPB10/PMA13/CTED11/RB10) IC1.35(AN11/PMA12/RB11) IC1.38(TCK/CTED2/RA1) IC1.39(RPF13/RF13) IC1.40(RPF12/RF12) IC1.41(AN12/PMA11/RB12) IC1.42(AN13/RB13) IC1.43(AN14/RPB14/PMA1/CTED5/RB14) IC1.44(AN15/RPB15/PMA0/CTED6//RB15) IC1.47(RPD14/RD14) IC1.48(RPD15/RD15) IC1.49(RPF4/PMA9/RF4) IC1.50(RPF5/PMA8/RF5) IC1.51(RPF3/USBID/RF3) IC1.58(SCL2/RA2) IC1.59(SDA2/RA3) IC1.60(TDI/CTED9/RA4) IC1.61(TDO/RA5) IC1.68(RPD8/RTCC/RD8) IC1.69(RPD9/RD9) IC1.70(RPD10/SCK1/PMCS2/RD10) IC1.71(RPD11/PMCS1/RD11) IC1.72(RPD0/INT0/RD0) IC1.73(SOSCI/RPC13/RC13) IC1.74(SOSCO/RPC14/T1CK/RC14) IC1.76(AN24/RPD1/RD1) IC1.77(AN25/RPD2/RD2) IC1.78(AN26/RPD3/RD3) IC1.79(RPD12/PMD12/RD12) IC1.80(PMD13/RD13) IC1.81(RPD4/PMWR/RD4) IC1.82(RPD5/PMRD/RD5) IC1.83(PMD14/RD6) IC1.89(RPG1/PMD9/RG1) IC1.90(RPG0/PMD8/RG0) IC1.91(TRCLK/RA6) IC1.92(TRD3/CTED8/RA7) IC1.93(PMD0/RE0) IC1.94(PMD1/RE1) IC1.95(TRD2/RG14) IC1.97(TRD0/RG13) IC1.98(AN20/PMD2/RE2) IC1.99(RPE3/PMD3/RE3) IC1.100(AN21/PMD4/RE4) IC3.9(PG) Q1.1(-A:S) Q1.2(-A:G) Q1.6(-A:D) Q1.P1(-A:D1) Q2.1(-A:S) Q2.2(-A:G) Q2.6(-A:D) Q2.P1(-A:D1) Q6.3(-B:D) Q6.4(-B:S) Q6.5(-B:G) Q7.2(-B:S) Q7.3(-B:G) Q7.4(-B:D) R2.3 R2.4 R2.5 R2.6 R7.1 R7.2 R7.7 R7.8 R9.1 R9.4 R9.5 R9.8

## Notes on the sheet
- Chce se pouzit 4 clankovy LiFEPO nominal 12,8V (4x3.2) bezne nabijeni max. 14,8V (4x3.7V) pocatecni iniciacini napijeni 16,0 nebo 16,8 (4x 4,0 nebo 4.2V) vrcho je tedy stejny jako u Lion
- Transil P6SMB16A standoff 13.6V  breakdown 15.2-16.8V/1mA  max power 22.5V/27A - NELZE POUZIT s 4 clankovym LIFEPO
- Transil P6SMB20A standoff 17.1V  breakdown 19-21V/1mA  max power 27,7V/22A
- dle DSH A,B funguji v rozsahu +12V/-7V, RS486 terminator 110R, differ. imp 54R 50pF
- dle DSH maji A, B vstupni odpor 180k do zdroje 1,6V s impedanci 18k (delic 36k/36k)
- diferencialni odpor mezi A-B je tedy cca 400k to odpovídá změřeným 0,42V s 3x1M
- dle mereni pri tomto zapojeni A,B na delic 1M-1M-1M je v klidu diferencni napeti 0,42V
- na A=2,01V na B=1,59V pri VCC=3,30V
- dle mereni spotreba 4,4mA - kdyz /RE=DE=0 je aktivni, nebudi linku a posloucha R=3,3V A>B R=0V A<B
- dle mereni spotreba 9,3mA - kdyz /RE=DE=1 je aktivni a budi linku A/B podle D
- spojeni /RE a DE je pekna prasarnicka dle DSH je jeden pull up 100k a druhy pull down 100k
- pri mereni zjistuji napeti 0,84V - oh shit nedefin 0.8-2.0V, 100k k GND 0,45V, 100k na +3,3V 2,32V
- spojeni /RE a DE ma impedanci cca 90k-150k -> pull down <20k, napeti je 0,84V a chova se to jako low ale je to nespolehlive!
- kdyz /RE=0 a B<A tak R=3.3V imp cca 30R,  kdyz /RE=1 tak R je Hiz je vhodne pull up
- dle mereni je D pullupovane cca 90-150k - neni nutny ext. pull up, kdyz D=1 tak B=0V a A=3,3V
- O
- I
- kam zapojit R132 je na zvazeni
  pokud za tranzistorem tak
  funguje jako protizkratovka
  otazka jestli je dobra
- USB+5V
- VBAT nom = 12.8V
- R132 zapojen pred Q5A 
  na vzorcich vc1-4 je R132 za Q5-A 
  a nefunguje to optimalne
- <-4,3-6,5uA/13V
- VPS-SENSE dat na AN+RP
- <-1uA
- <-2.5uA
- <-2.5uA
- tau=0,56ms
- stabilization <0,1% 0,8ms | tau=0,5ms  1n/0,5M
- kond u PICA
- tau=0,11ms
- <-3.3uA/3.3V
- <-8,7uA/2,6V | Ugs=0,64V
- <-3.3uA/3.3V
- <-8,7uA/2,6V
- 2,5V@1A (0,025R)
- C66 near PIC
- merici krok na ADC 25,0mV
- rozsah do 25,6V ->2,50V
- ratio 1:100   supply curr 1uA  out imp 10k
- C63 R99 R98 must be near IC16B
- stabilization  <0,1% 5ms
- C62 R96 R95 must be near IC16B
- tau=0,22ms
- C36 near PIC
- 1M/100nF/300k:
- C64 near PIC
- tONtime=50ms rise time 20ms  max.dU/dt=0,5V/1ms max. curr. 0,5A @ 1000uF
- tOFFtime=150ms  fall time 50ms
- Vyzkouset funkci EN pri 6V a pokud nebude potreba | pri REF = 2,5V je merici rozasah do 25,58V => 2,50V na ADin
- FDG6303N   IDS/UGS 1-10uA/0,6-0,7V ISD<0,2uA/0,55V 90pA/0V 2,1nA/0,23V 220nA/0,55V  8uA/0,66V
- tak R21 odstranit a spoji JP1 2-3
- delici pomer 1 : 0,09757 a mereny dilek 25,0mV (24,98mV)
- SSM6P49NU  IGS/UGS  9,5nA/3,5V  20nA/5V 0,2uA/10V
- JP1  1-2  IC8 startuje pri 5,8-6,0V a to hnusne - je to nanic, mala hyst pokmitava v 5,8-6,0V | SSM6P49NU  IDS=0,1-1A/UGS=1,2-1,3V/UDS=3-15V
- JP1  2-3   IC8 startuje pry pri  4,3V (dle DSH) ale | SSM6P49NU  RDSON=0,08/UGS=1,8V(max. by DSH 0,15)    RDSON=0,06/UGS=2,5V(max. by DSH 0,08)
- IDS 0,01->1A / UGS=1.2->1.3V
- IC8 funguje uz pri 3,8V (zmereno) dava 3,2V
- IDS 150uA / UGS=0.68V
- na USB J12 musi byt 4,2V pro napajeni z USB
- IC1 (PIC) funguje od 2,2V (zmereno)
- zatez 10uF na desce
- SRAM,2xEEPROM,LATCHe 0,5uA
- tedy nema smysl vypinat
- spinani 100us pri 10uF+22R zatezi | THR=1.0V
- max. dU/dT=1V/30us na 10uF => 300mA
- 1.19V
- 835kHz
- JEN VYPOCTY - NEOVERENO!
- utlum 10R 20uF  RC=0,2ms
- tlumivka 3.3uH je jen pro pocit
- starup 0V->3,25V(-0,05V) 1ms
- 60dB s 20uF udela az na 0,8Mhz
- 7dB@1kHz
- a vyznamnejsi nez 10R se stava az nad 3Mhz
- 22dB@10kHz
- pokud R=3R pak 3uH a 20uF staci pri >500kBps | 42dB@100kHz
- R>=1R zachovat vzdy! | 62dB@1MHz
- Udaje o PSRR ADC PIC nejsou
- Melo by byt >60dB@1kHz >40dB@10kHz a >20dB@100kHz
- 20uF pri odberu 5mA udrzi 10us pokles napeti pod 1:1000 (60dB)
- 20uF s L=3,3uH 1R<R<3R 60dB pro 800kHz
- 4,5mV | RC 10R 20uF = 200us overeno merenim
- zatez 10uF na desce
- spinani 100us pri 10uF
- max. dU/dT=1V/30us na 10uF => 300mA | 0,45mA
- IC12 RS485 odber cca 5mA
- AVDD max. +/-0.3V od VDD
- added EMI choke
- I in ->
- 0.1uF->1uF
- CN,INT3
- PWM OCx
- 6-27Mhz | PWM OC1
- added EMI choke
- CN,INT2
- V datshitu DS60001185F-page 318 je uvedeno,
  ze AN15-AN27 jsou na hovno....  pice...
  CURR-SENSE je na AN19
  asi by slo prohodit s /3.3V1PWRON
- added 1000uF
- OC4 | PWM OCx
- INT3,AN18 | CN,INT3 | IC7 power consuption =  22uA + 19% I in
- FLASH SPI SO08(150mil) 32Mb
- efficiency 81% *  ( Iin -27uA) / I in
- MB v5.91 M25P16-VMN6P - obsolete
- U2RX
- MB v5.92  N25Q032A13ESC  obsolete
- 6.6.2017 found:
- AN19 | U2TX
- AT25SF321-SSHD
- MX25R3235FM1IH0
- IS25LQ032B-JNLE
- Power Consuption
- 1.6.2015 v5.9  pridat RC FILTR 1R/2x47uF  a DC vazba je az R84
- 50mA/100Mhz | otestovalo se to a zda se to dobre
- neni RP->
- 5mA/10Mhz
- neni RP->
- INT2
- 0,1mA/31kHz LPRC
- pokud mozno
- neobsazovat USB
- INTx
- INT4
- WAKEUP
- CN,INT3
- INTx
- INT1
- DMA CLK
- AN6 | AN6
- AN7 | U3TX
- tlumivka do serie s 300R nema smysl
- U3RX
- aby se projevila na 100kHz a vic muse by byt 100uH
- utlum 300R 0,2uF  RC=0,06ms
- starup 0V->2,7V 1ms | REF3025
- 1dB@100Hz | PSRR 65dB@100Hz | 0,22mA
- 3dB@1kHz | PSRR 45dB@1kHz
- 11dB@10kHz | PSRR 25dB@10kHz
- 31dB@100kHz | PSRR 5dB@100kHz
- 66mV
- 300R 0,2uF+ REF3025 30-40dB -> odfiltruje AC az +/-0.1V -> +/-1mV na 2.5V
- prechodovy dej po velke zmene odberu 0->5mA
- se zatezi 0,1-1uF dozni po max. 100us dle DSH
- RC 300R 200nF cca 60us overeno merenim
- prechodovy pri ADON,REFEN=0->1 cca 250us
- Iquesc=42uA
- tzn. pri odberu cca 0,22mA
- vlastni odber 40uA (zmereno)
- TP1 musi byt pristupny pri testovani desky
- Doba ustaleni 2.5V je  250us (zmereno) se zatezi 0,22mA (ADC ON)
- PWM OC5
- neobsazovat USB
- neobsazovat USB
- neobsazovat USB
- CN,INT3
- CN,INT4
- pokud mozno neobsazovat USB
- 4M99/180k/750k
  THRon=9.79V
  THRoff=7.89V
- ZAPOJENO pres odpor 100k na PGD
- toto spina velmi tvrde ale tady to vubec nevadi, ale nekopirovat to jinam
- zmena FDC6324 -> FDC6330 ktery je na LAN ADAPT
- <-3.3uA/3.3V
- <-8,7uA/2,6V | Ugs=0,64V
- Actuator driver
- Turn-on THR 6,3V max 6,8V
- Turn-off THR 5,5V max 6,0V
- Actuators
- 4x10K
- PWM Current limit set to:
- 4x1M
- Imax=3.3V*(301/(301+3300)/0.1R=2.75A
- shorted on PCB
- Imax=3.3V*(301/(301+4990)/0.1R=1.87A
- eLock mainboard
- 5.92

## Library data of the parts
C1 C38 = DISCRETE:C-0805
C2-C8 C12 C24-C28 C33-C37 C39-C41 C43 C44 C47-C53 C55 C57-C67 C69 C70 C85 C88 = DISCRETE:C-0603
C22 C23 C29 C30 = DISCRETE:C-1206: Capacitor 1206
C31 C81 = SmdDisc:CT
C54 C56 C86 = DISCRETE:CT-1206
C83 C84 = SMD-ELYT:CAP-ELEC-SMD
D1 = Fairchild-AON:BAT54S: Schottky diode dual 30V 200mA
D2 = st-microelectronics-AOM:SMLVT3V3: TVS 600W 4.1 Breakdown
D3 D4 D8 = Littelfuse:P6SMB: P6SMB20A TVS Unidirectional 17.1V 1uA, 19.0-21.0V@1mA breakdown, 27.7V@22A P6SMB16A TVS Unidirectional 13.6V 1uA, 15.2-16.8V@1mA breakdown, 22.5V@27A
D5 = DISCRETE:LED-0805
D6 D7 = SmdDisc:DS: Diody schotki: 1) BAT48 MELF1406 signalova 40V 0,3V/10mA 0,5V/0,2A 30pF,10pF/5V 3uA/50°C 2) SS14 SMA power 40V 0,2V/10mA 0,4V/1A 300pF,60pF/20V 200uA/75°C
D9 = Fairchild-AON:BZX84C: Diode Zener SOT23
F1 = ArdDisp:POJISTKA: Pojistka 1) klasicka 5x20 ve vyvodovem pouzdru KS20SW 2) SMD 2410 (6x2,6mm) v pouzdru Littlefuse 0154
IC1 = ACB:PIC32MX470F512L: Jara 6.6.2017 sym, pac12x12 a pac 14x14 a zapojeni dev importovano z PIC32MX470F512L-80I_PF.bxl ...._PT.bxl
IC2 = st-microelectronics-AOM:L6227: DMOS dual full bridge driver with PWM 2A, 0.7Ohm 52V
IC3 = ACB:LT3971: Stepdown 1,2A 4,3-38Vin 1,2-30Vout 0,2-2Mhz 2,5uAquesc, SS, accurate EN 1,0V 5,6$ http://cds.linear.com/docs/en/datasheet/3971fd.pdf Hořa 7.6.2017 opravil Jara pozdeji
IC6 = ArdDisp:MIC841: Comparator intREF 1,24V 1,5-5,5V 1,5uA hyst-set-by-Rdiv (2x comp+RS), speed 15us/100mV 80us/10mV, types: MIC841Lxx push-pull if HTH>ref then low, MIC841Hxx push-pull if HTH>ref then high, MIC841Nxx open drain if HTH>ref then high imp
IC7 IC11 = Microchip-AON:24*: Serial EEPROM I2C
IC9 = Micron-U:M25P16: 16Mbit low voltage SPI Flash
IC10 = Touchstone-U:TSM9938: IC OPAMP CURRENT SENSE SOT23-5
IC12 = TexasInstruments-AON:SN65HVD3082E: RS-422/485 TRX 1RX 1TX
IC13 = ACB:REF3025: REF3025 2.5V 0,2% 42uA Hora
IC14 IC15 = Semtech-AOM:SR05: IC TVS ARRAY 2-LINE 5V SOT-143
IC16 = Microchip-AON:MCP6042: OAMP 14kHz LowPower 0,6uA G=1 stable OutCapLoad 70p/50k 10n/10k RailToRail VSS+0,4V VDD-0,5V
J3 J4 = ACB:RJ8-8
J12 = ACB:USB: USB connector Type A Copy from TTSKK and redesign. Hořa 10.6.2017
J14 J15 = Tyco-U:3-641215-5: Connector 5 pin 100 mil
J17 = CON-pinHeader-AON:MA05-1
JP1 = SmdDisc:JP3CLOSE12
L2 = DISCRETE:L-0805-0R
L7 L8 L10-L13 = DISCRETE:L-1206
L9 = Sumida-UT:NR6028: NR6028, NRS6028 6x6x2,5mm, NR6045, NRS6045 6x6x4,5mm
O1 O23 O31 O44 T1 T5 T7 T15 T27 T32 T33 T36 = TESTPAD:PIC-OUT: Docasna soucastka na smerovani wire k procesoru bez pripojeni k procesoru
O5-O8 O12 O13 O15 O16 O29 O30 O41 O42 T3 T13 T14 T45 = TESTPAD:PIC-RPX: Docasna soucastka na smerovani wire k procesoru bez pripojeni k procesoru
Q1 Q2 = Toshiba-AON:SSM6P49: MOSFET P-CH DUAL 30V UDFN6, 4A, 20V
Q3 = Fairchild-AON:FDC6330: IC LOAD SWITCH INT 20VIN SSOT-6, 80mOhm, 2.5A
Q4 Q6 = Fairchild-AON:FDG6303N: Dual N-channel digital FET 25V/0.5A 0.45Ohm
Q5 Q7 = Fairchild-AON:FDC6506D: Dual P-Channel Logic Level PowerTrench MOSFET -1.8A, -30 V RDS(on) = 0.170 Ohm @ VGS = -10 V RDS(on) = 0.280 Ohm @ VGS = -4.5 V
R1 R2 R7 R9-R11 R50 = Panasonic-AON:EXB-38: Resistor array 4x
R3 R6 R8 R12-R14 R17-R34 R40-R49 R65 R71-R73 R75 R77 R82 R90-R103 R128-R130 R132 = DISCRETE:R-0603
R4 R5 R35-R39 R105 R106 = DISCRETE:R-0805
REF1 REF2 = technol:REF
T37-T39 = TESTPAD:PIN-AN: Docasna soucastka na smerovani wire k procesoru bez pripojeni k procesoru
TP1 TP2 TP4 = TESTPAD:ROUND_SMD: Generic round SMD testpad
X1 = TXC_Tech-U:XTAL

## Net classes
1 HV: clearance 0.3 mm to class 0